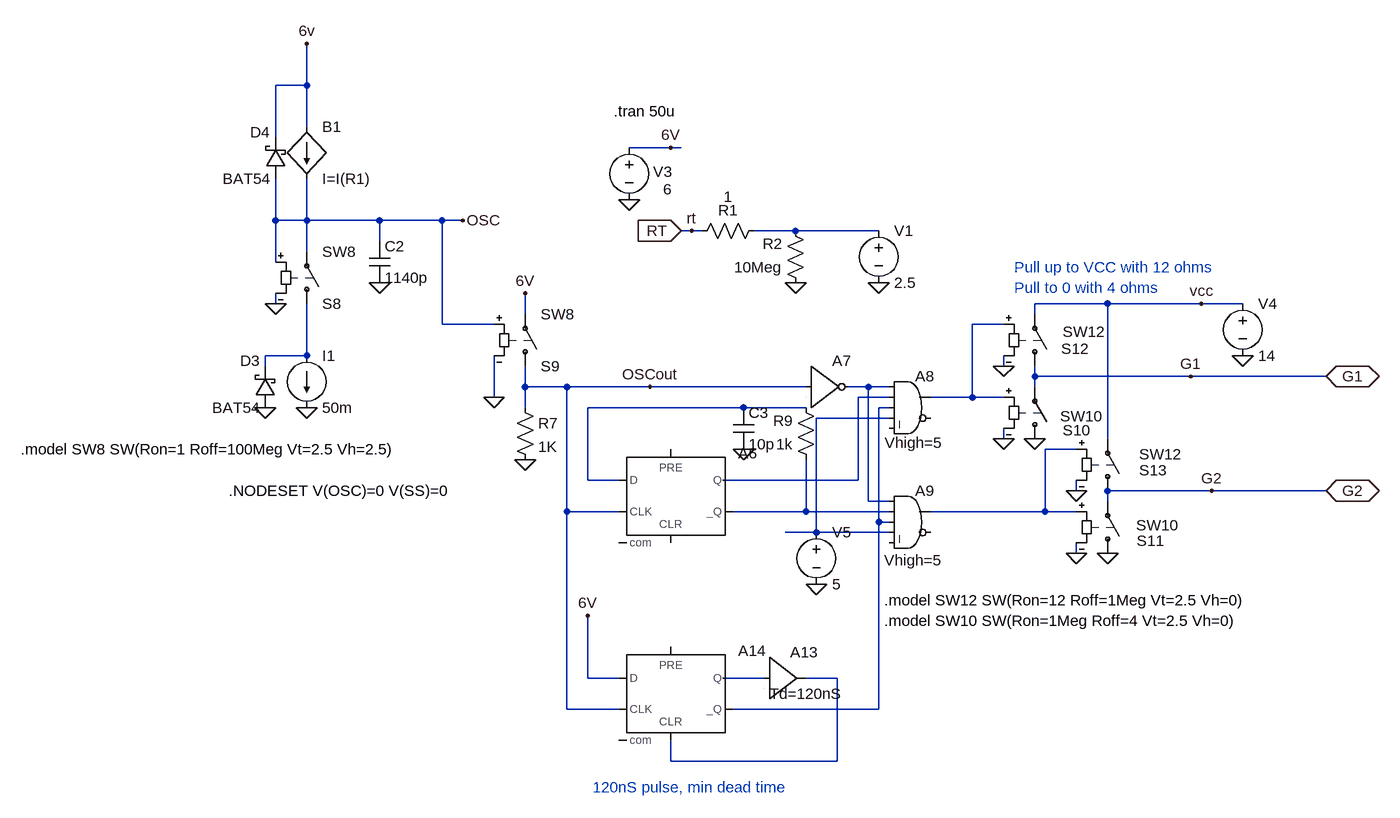
[diagram p0: schematic ucc25600_VCO.asc]
ucc25600_VCO.asc, the LTspice schematic file:
Version 4
SHEET 1 3548 2024
WIRE 1504 192 1504 128
WIRE 1504 192 1456 192
WIRE 1504 256 1504 192
WIRE 1456 272 1456 192
WIRE 2064 288 2000 288
WIRE 2080 288 2064 288
WIRE 1456 400 1456 336
WIRE 1504 400 1504 336
WIRE 1504 400 1456 400
WIRE 1616 400 1504 400
WIRE 1712 400 1616 400
WIRE 1744 400 1712 400
WIRE 2096 416 2080 416
WIRE 2112 416 2096 416
WIRE 2256 416 2192 416
WIRE 2384 416 2256 416
WIRE 1616 432 1616 400
WIRE 1504 448 1504 400
WIRE 1456 464 1456 400
WIRE 1456 528 1456 512
WIRE 2736 528 2624 528
WIRE 2880 528 2736 528
WIRE 2944 528 2880 528
WIRE 1840 544 1840 512
WIRE 2624 544 2624 528
WIRE 1712 560 1712 400
WIRE 1792 560 1712 560
WIRE 2576 560 2528 560
WIRE 1504 608 1504 528
WIRE 1504 608 1440 608
WIRE 1440 624 1440 608
WIRE 2576 624 2576 608
WIRE 2624 640 2624 624
WIRE 2864 640 2624 640
WIRE 3072 640 2864 640
WIRE 1840 656 1840 624
WIRE 1904 656 1840 656
WIRE 2032 656 1904 656
WIRE 2272 656 2032 656
WIRE 2368 656 2336 656
WIRE 2400 656 2368 656
WIRE 2624 656 2624 640
WIRE 1792 672 1792 608
WIRE 2400 672 2352 672
WIRE 2528 672 2528 560
WIRE 2528 672 2464 672
WIRE 2576 672 2528 672
WIRE 1840 688 1840 656
WIRE 2176 688 1936 688
WIRE 2272 688 2176 688
WIRE 2400 688 2384 688
WIRE 2400 704 2288 704
WIRE 2576 736 2576 720
WIRE 2736 736 2736 528
WIRE 2688 752 2640 752
WIRE 1936 800 1936 688
WIRE 1984 800 1936 800
WIRE 2352 800 2352 672
WIRE 2352 800 2144 800
WIRE 2688 816 2688 800
WIRE 2896 816 2736 816
WIRE 3072 816 2896 816
WIRE 2368 832 2368 656
WIRE 2400 832 2368 832
WIRE 2736 832 2736 816
WIRE 1904 848 1904 656
WIRE 1984 848 1904 848
WIRE 2272 848 2272 768
WIRE 2272 848 2160 848
WIRE 2400 848 2272 848
WIRE 2640 848 2640 752
WIRE 2640 848 2464 848
WIRE 2688 848 2640 848
WIRE 2384 864 2384 688
WIRE 2400 864 2384 864
WIRE 2288 880 2288 704
WIRE 2288 880 2240 880
WIRE 2400 880 2288 880
WIRE 2688 912 2688 896
WIRE 1936 1104 1936 1008
WIRE 1984 1104 1936 1104
WIRE 2208 1104 2144 1104
WIRE 2320 1104 2272 1104
WIRE 1904 1152 1904 848
WIRE 1984 1152 1904 1152
WIRE 2384 1152 2384 864
WIRE 2384 1152 2160 1152
WIRE 2064 1232 2064 1200
WIRE 2320 1232 2320 1104
WIRE 2320 1232 2064 1232
FLAG 2000 368 0
FLAG 2064 288 6V
FLAG 1504 688 0
FLAG 1504 128 6v
FLAG 1616 496 0
FLAG 1440 688 0
FLAG 1456 528 0
FLAG 1744 400 OSC
FLAG 1792 672 0
FLAG 1840 768 0
FLAG 2032 656 OSCout
FLAG 1840 512 6V
FLAG 2576 736 0
FLAG 2688 912 0
FLAG 2736 912 0
FLAG 2624 736 0
FLAG 2576 624 0
FLAG 2688 816 0
FLAG 1936 1008 6V
FLAG 2176 752 0
FLAG 2944 608 0
FLAG 2880 528 vcc
FLAG 2864 640 G1
FLAG 2896 816 G2
FLAG 2288 960 0
FLAG 3072 640 G1
IOPIN 3072 640 BiDir
FLAG 3072 816 G2
IOPIN 3072 816 BiDir
FLAG 2256 496 0
FLAG 2096 416 rt
FLAG 2080 416 RT
IOPIN 2080 416 In
FLAG 2384 496 0
SYMBOL voltage 2000 272 R0
WINDOW 123 0 0 Left 2
WINDOW 39 0 0 Left 2
WINDOW 0 37 53 Left 2
WINDOW 3 52 80 Left 2
SYMATTR InstName V3
SYMATTR Value 6
SYMBOL cap 1600 432 R0
SYMATTR InstName C2
SYMATTR Value 1140p
SYMBOL schottky 1456 688 R180
WINDOW 0 24 72 Left 2
WINDOW 3 24 0 Left 2
SYMATTR InstName D3
SYMATTR Value BAT54
SYMATTR Description Diode
SYMATTR Type diode
SYMBOL sw 1504 544 M180
SYMATTR InstName S8
SYMATTR Value SW8
SYMBOL schottky 1472 336 R180
WINDOW 0 24 72 Left 2
WINDOW 3 24 0 Left 2
SYMATTR InstName D4
SYMATTR Value BAT54
SYMATTR Description Diode
SYMATTR Type diode
SYMBOL sw 1840 640 M180
SYMATTR InstName S9
SYMATTR Value SW8
SYMBOL res 1824 672 R0
SYMATTR InstName R7
SYMATTR Value 1K
SYMBOL Digital\\dflop 2064 752 R0
WINDOW 3 0 0 Invisible 2
SYMATTR Value Vhigh=5
SYMATTR InstName A6
SYMBOL Digital\\inv 2272 592 R0
WINDOW 3 -21 100 Invisible 2
SYMATTR Value Vhigh=5
SYMATTR InstName A7
SYMBOL Digital\\and 2432 624 R0
WINDOW 3 -39 118 Left 2
SYMATTR Value Vhigh=5
SYMATTR InstName A8
SYMBOL Digital\\and 2432 800 R0
WINDOW 3 -40 123 Left 2
SYMATTR Value Vhigh=5
SYMATTR InstName A9
SYMBOL sw 2624 752 M180
WINDOW 0 43 29 Left 2
WINDOW 3 39 51 Left 2
SYMATTR InstName S10
SYMATTR Value SW10
SYMBOL sw 2736 928 M180
WINDOW 0 45 35 Left 2
WINDOW 3 44 59 Left 2
SYMATTR InstName S11
SYMATTR Value SW10
SYMBOL sw 2624 640 M180
WINDOW 0 41 43 Left 2
WINDOW 3 43 69 Left 2
SYMATTR InstName S12
SYMATTR Value SW12
SYMBOL sw 2736 832 M180
WINDOW 0 49 48 Left 2
WINDOW 3 49 72 Left 2
SYMATTR InstName S13
SYMATTR Value SW12
SYMBOL Digital\\dflop 2064 1056 R0
WINDOW 3 0 0 Invisible 2
SYMATTR Value Vhigh=5
SYMATTR InstName A14
SYMBOL Digital\\buf1 2208 1040 R0
WINDOW 3 8 60 Invisible 2
WINDOW 123 8 88 Left 2
SYMATTR Value Vhigh=5
SYMATTR Value2 Td=120nS
SYMATTR InstName A13
SYMBOL res 2288 784 R180
WINDOW 0 36 76 Left 2
WINDOW 3 36 40 Left 2
SYMATTR InstName R9
SYMATTR Value 1k
SYMBOL cap 2160 688 R0
SYMATTR InstName C3
SYMATTR Value 10p
SYMBOL voltage 2944 512 R0
WINDOW 123 0 0 Left 0
WINDOW 39 0 0 Left 0
SYMATTR InstName V4
SYMATTR Value 14
SYMBOL voltage 2288 864 R0
WINDOW 123 0 0 Left 0
WINDOW 39 0 0 Left 0
SYMATTR InstName V5
SYMATTR Value 5
SYMBOL current 1504 608 R0
WINDOW 123 0 0 Left 0
WINDOW 39 0 0 Left 0
SYMATTR InstName I1
SYMATTR Value 50m
SYMBOL bi 1504 256 R0
SYMATTR InstName B1
SYMATTR Value I=I(R1)
SYMBOL res 2272 512 R180
WINDOW 0 36 76 Left 2
WINDOW 3 36 40 Left 2
SYMATTR InstName R2
SYMATTR Value 10Meg
SYMBOL voltage 2384 400 R0
WINDOW 123 0 0 Left 0
WINDOW 39 0 0 Left 0
SYMATTR InstName V1
SYMATTR Value 2.5
SYMBOL res 2208 400 R90
WINDOW 0 0 56 VBottom 2
WINDOW 3 -52 56 VTop 2
SYMATTR InstName R1
SYMATTR Value 1
TEXT 1064 752 Left 2 !.model SW8 SW(Ron=1 Roff=100Meg Vt=2.5 Vh=2.5)
TEXT 2392 984 Left 2 !.model SW12 SW(Ron=12 Roff=1Meg Vt=2.5 Vh=0)
TEXT 2392 1016 Left 2 !.model SW10 SW(Ron=1Meg Roff=4 Vt=2.5 Vh=0)
TEXT 1384 816 Left 2 !.NODESET V(OSC)=0 V(SS)=0
TEXT 2592 472 Left 2 ;Pull up to VCC with 12 ohms\nPull to 0 with 4 ohms
TEXT 1944 1272 Left 2 ;120nS pulse, min dead time
TEXT 1976 232 Left 2 !.tran 50u

The netlist it stands for:
* ucc25600_VCO.asc
V3 6V 0 6
C2 OSC 0 1140p
D3 0 N003 BAT54
S8 N003 OSC OSC 0 SW8
D4 OSC 6V BAT54
S9 OSCout 6V OSC 0 SW8
R7 OSCout 0 1K
A6 N006 0 OSCout 0 0 N010 N005 0 DFLOP Vhigh=5
A7 OSCout 0 0 0 0 N004 0 0 BUF Vhigh=5
A8 N004 N005 N007 N008 0 0 N002 0 AND Vhigh=5
A9 N004 N010 N007 N008 0 0 N009 0 AND Vhigh=5
S10 0 G1 N002 0 SW10
S11 0 G2 N009 0 SW10
S12 G1 vcc N002 0 SW12
S13 G2 vcc N009 0 SW12
A14 6V 0 OSCout 0 N012 N007 N011 0 DFLOP Vhigh=5
A13 N011 0 0 0 0 0 N012 0 BUF Vhigh=5 Td=120nS
R9 N010 N006 1k
C3 N006 0 10p
V4 vcc 0 14
V5 N008 0 5
I1 N003 0 50m
B1 6V OSC I=I(R1)
R2 0 N001 10Meg
V1 N001 0 2.5
R1 N001 rt 1
.model D D
.lib standard.dio
.model SW8 SW(Ron=1 Roff=100Meg Vt=2.5 Vh=2.5)
.model SW12 SW(Ron=12 Roff=1Meg Vt=2.5 Vh=0)
.model SW10 SW(Ron=1Meg Roff=4 Vt=2.5 Vh=0)
.NODESET V(OSC)=0 V(SS)=0
* Pull up to VCC with 12 ohms
* Pull to 0 with 4 ohms
* 120nS pulse, min dead time
.tran 50u
.backanno
.end